# EAGLE design ProcessorTestBoardV2 (EAGLE 7.7.0)
Small breakout board to test basic funtionality of processor. Contains programming connectors, I2C IR sensors, 3V3 and 3V6 voltage regulators, a bus switch, and the MRAM.
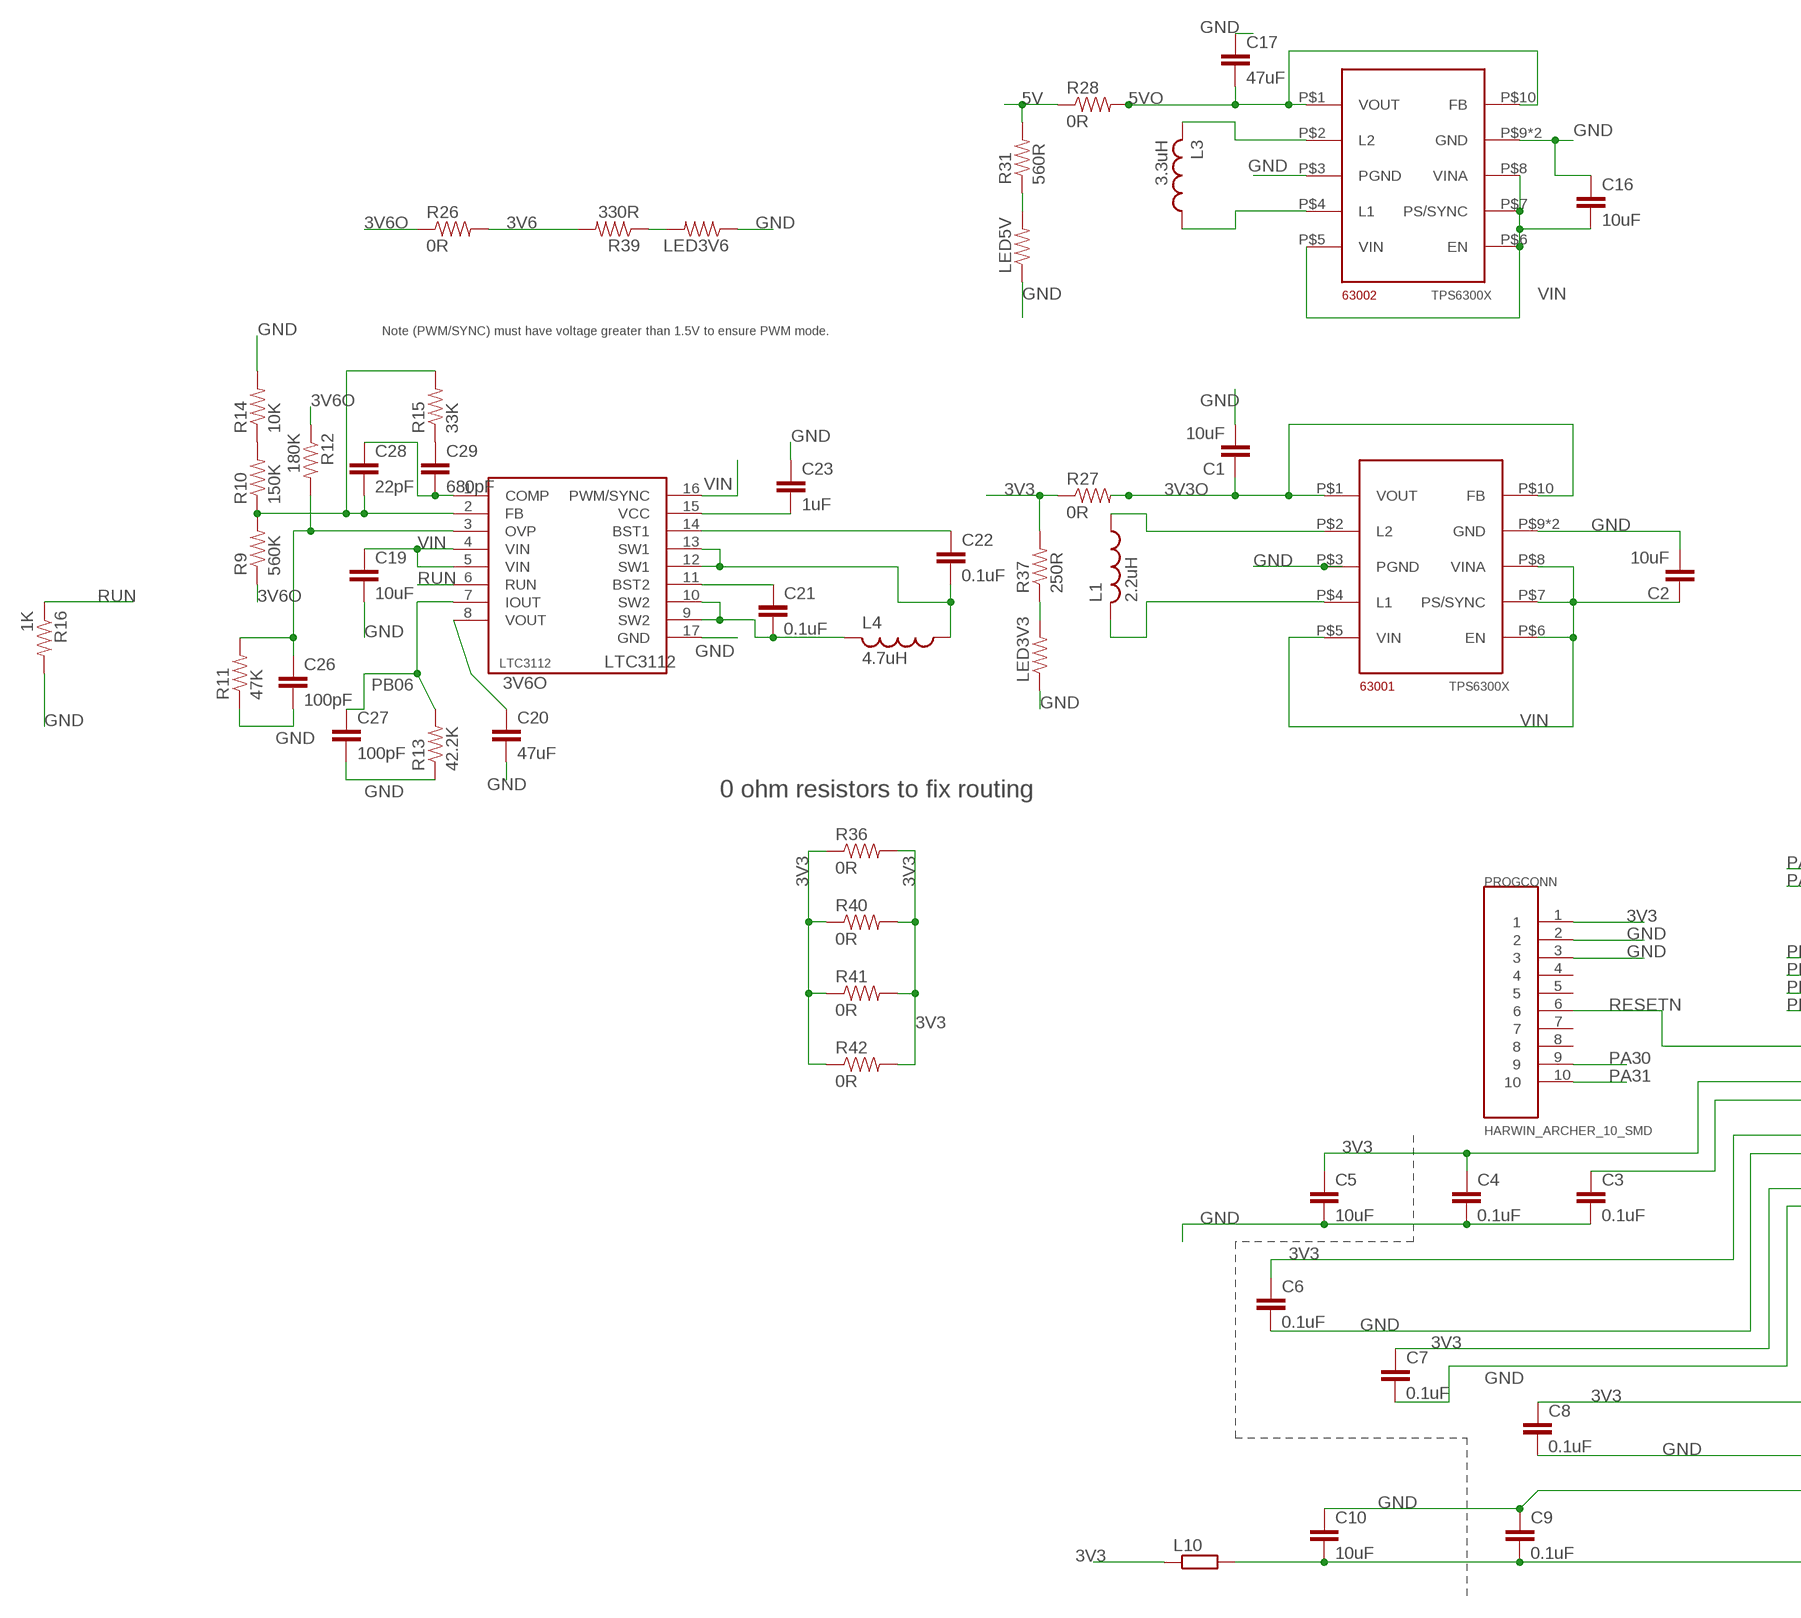
[diagram p0: schematic, sheet 1, part 1 of 2]
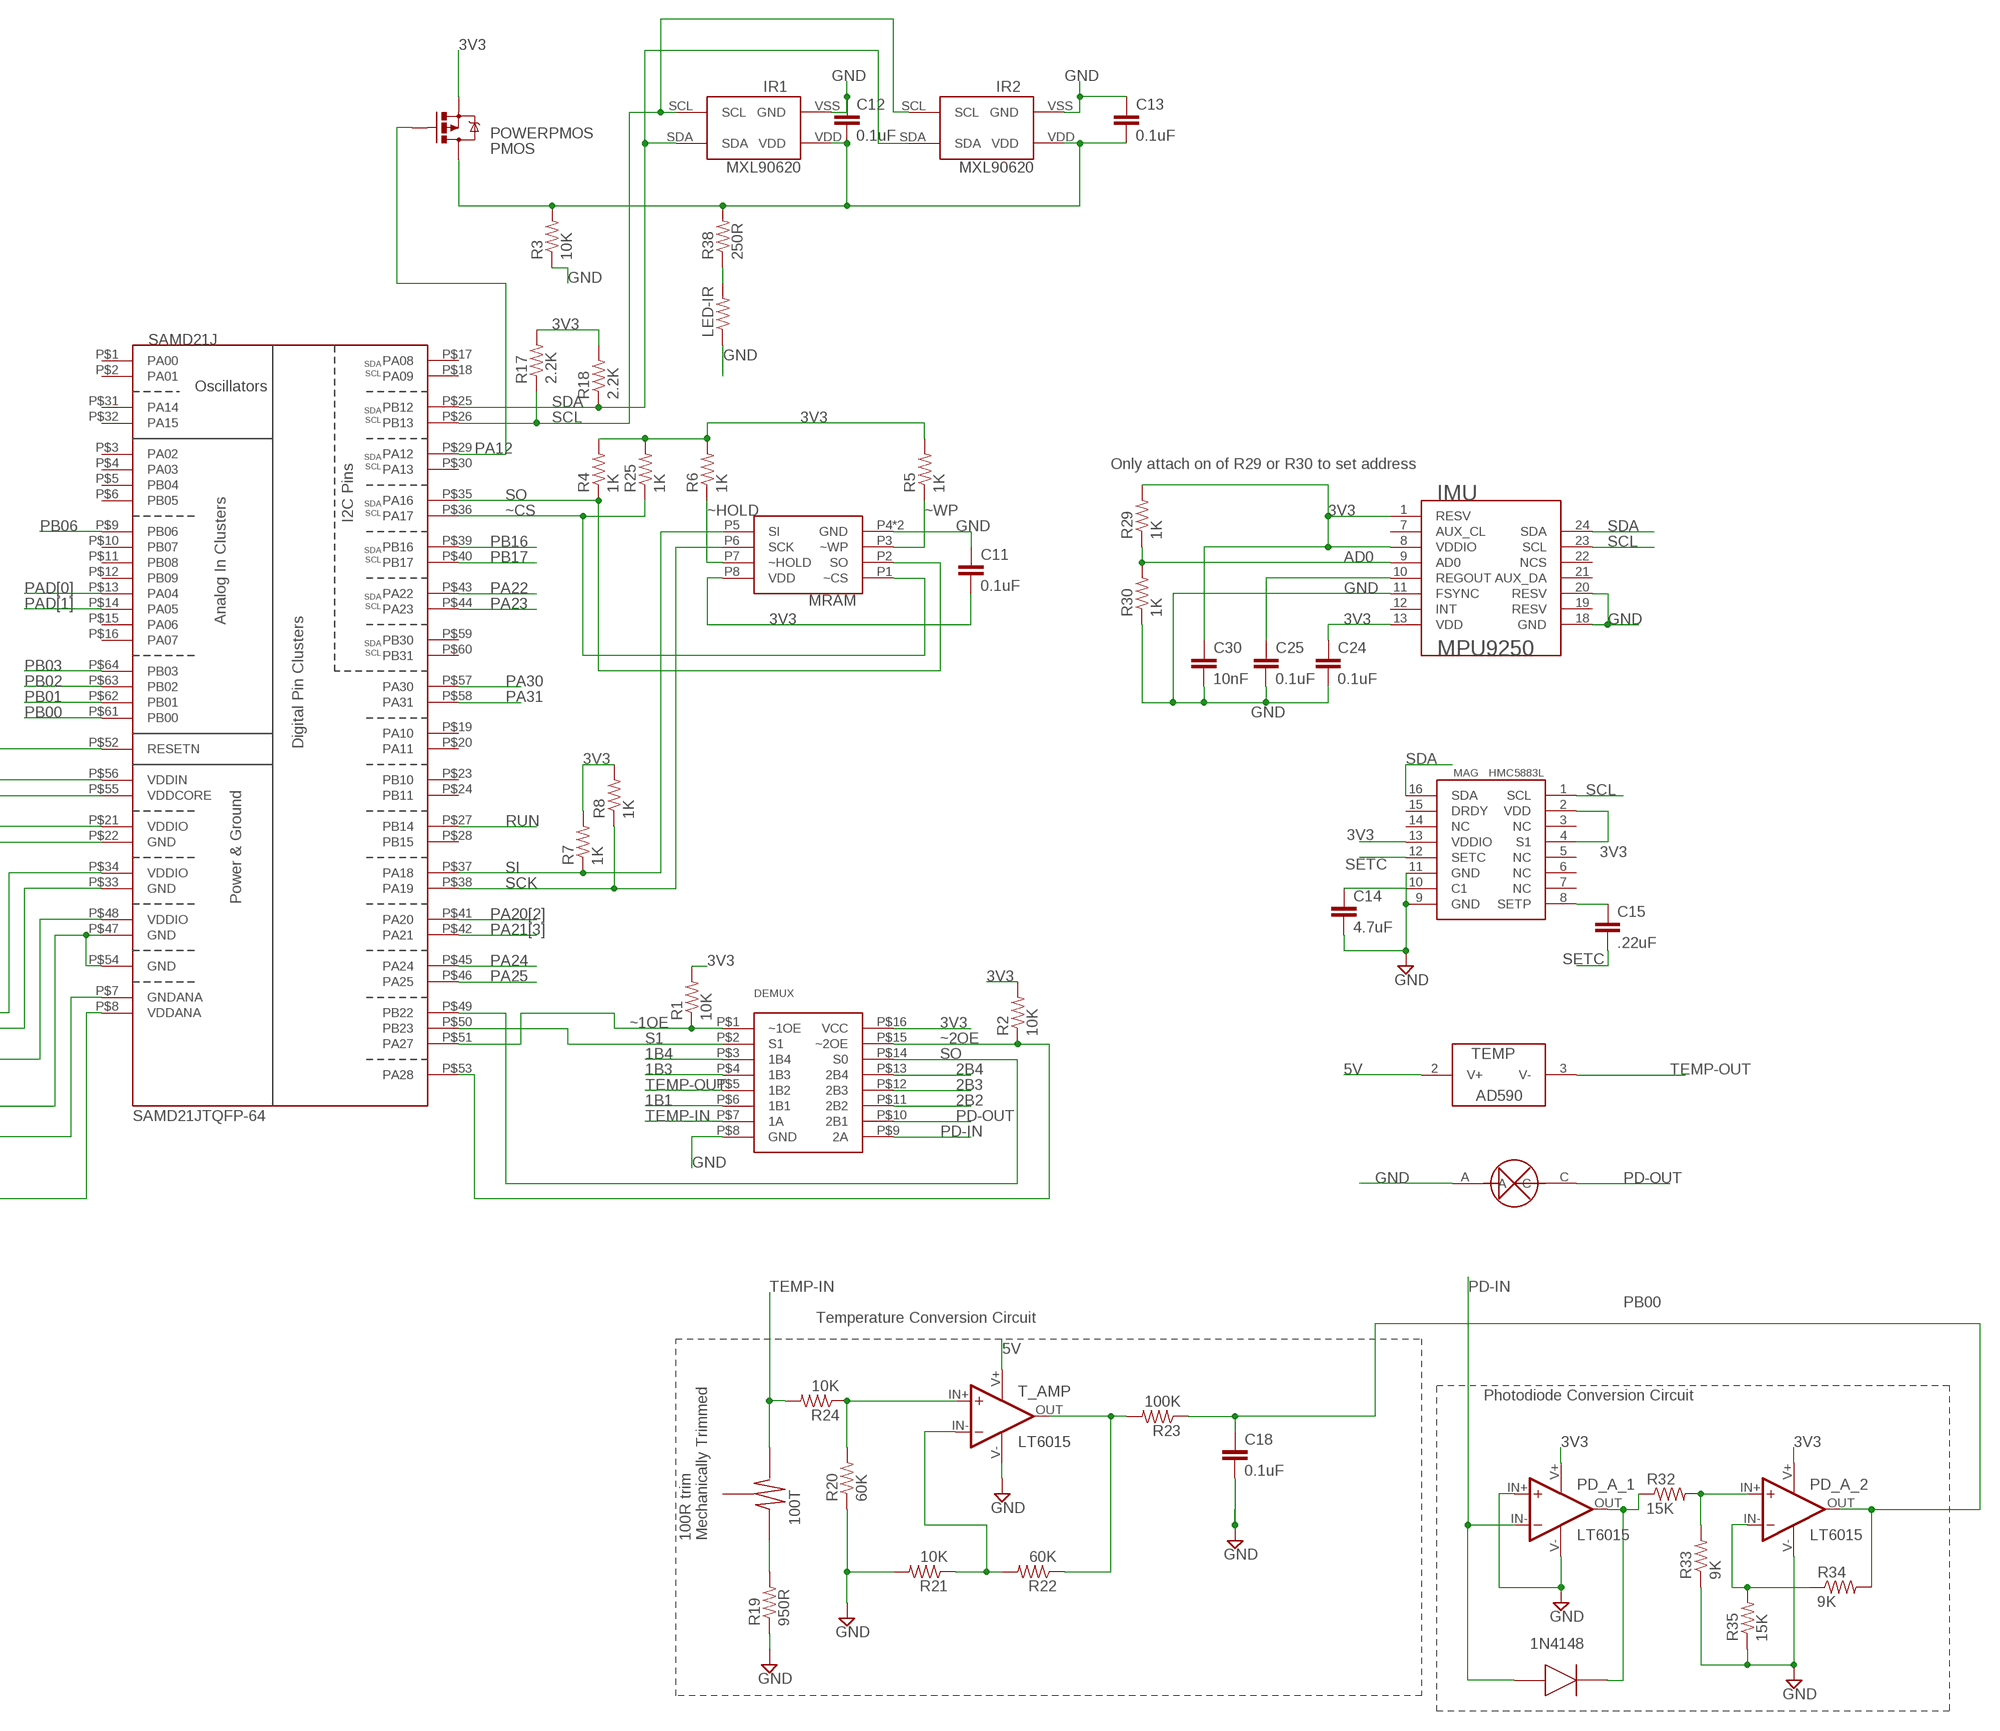
[diagram p1: schematic, sheet 1, part 2 of 2]

## Parts
1N4148  1N4148WS  [SOD-323F]
100T  TRIMPOT-TC33  [TC33X-2]
63001  TPS6300X  [QFN10_POWERPAD]
63002  TPS6300X  [QFN10_POWERPAD]
C1  10uF  CAP0805  [0805]
C2  10uF  CAP0805  [0805]
C3  0.1uF  CAP0805  [0805]
C4  0.1uF  CAP0805  [0805]
C5  10uF  CAP0805  [0805]
C6  0.1uF  CAP0805  [0805]
C7  0.1uF  CAP0805  [0805]
C8  0.1uF  CAP0805  [0805]
C9  0.1uF  CAP0805  [0805]
C10  10uF  CAP0805  [0805]
C11  0.1uF  CAP0805  [0805]
C12  0.1uF  CAP0805  [0805]
C13  0.1uF  CAP0805  [0805]
C14  4.7uF  CAP0805  [0805]
C15  .22uF  CAP0805  [0805]
C16  10uF  CAP0603-CAP  [0603-CAP]
C17  47uF  CAP0603-CAP  [0603-CAP]
C18  0.1uF  CAP0805  [0805]
C19  10uF  CAP0603-CAP  [0603-CAP]
C20  47uF  CAP0805  [0805]
C21  0.1uF  CAP0603-CAP  [0603-CAP]
C22  0.1uF  CAP0603-CAP  [0603-CAP]
C23  1uF  CAP0603-CAP  [0603-CAP]
C24  0.1uF  CAP0805  [0805]
C25  0.1uF  CAP0805  [0805]
C26  100pF  CAP0805  [0805]
C27  100pF  CAP0805  [0805]
C28  22pF  CAP0805  [0805]
C29  680pF  CAP0805  [0805]
C30  10nF  CAP0805  [0805]
DEMUX  SN74CBTLV3253  [SOIC16R]
IMU  MPU9250  [QFN-24-3X3]
IR1  MXL90620  [MXL90620]
IR2  MXL90620  [MXL90620]
L1  2.2uH  L-USL3225M  [L3225M]
L3  3.3uH  L-USL3225M  [L3225M]
L4  4.7uH  L-USL3225M  [L3225M]
L10  R-EU_R0805  [R0805]
LED3V3  RESISTOR  [0805]
LED3V6  RESISTOR  [0805]
LED5V  RESISTOR  [0805]
LED-IR  RESISTOR  [0805]
LTC3112  LTC3112  [DHD16]
MAG  HMC5883L  [HMC5883L]
MRAM  MR25H10CDC  [8PXMO-229]
PD  PHOTODETECTOR  [PHOTODECTORDEVICE2]
PD_A_1  LT6015  [SOT23-5]
PD_A_2  LT6015  [SOT23-5]
PMOS  POWERPMOS  [SO08]
PROGCONN  HARWIN_ARCHER_10_SMD  [HARWIN_ARCHER_10_SMD]
R1  10K  RESISTOR  [0805]
R2  10K  RESISTOR  [0805]
R3  10K  RESISTOR  [0805]
R4  1K  RESISTOR  [0805]
R5  1K  RESISTOR  [0805]
R6  1K  RESISTOR  [0805]
R7  1K  RESISTOR  [0805]
R8  1K  RESISTOR  [0805]
R9  560K  RESISTOR  [0805]
R10  150K  RESISTOR  [0805]
R11  47K  RESISTOR  [0805]
R12  180K  RESISTOR  [0805]
R13  42.2K  RESISTOR  [0805]
R14  10K  RESISTOR  [0805]
R15  33K  RESISTOR  [0805]
R16  1K  RESISTOR  [0805]
R17  2.2K  RESISTOR  [0805]
R18  2.2K  RESISTOR  [0805]
R19  950R  RESISTOR  [0805]
R20  60K  RESISTOR  [0805]
R21  10K  RESISTOR  [0805]
R22  60K  RESISTOR  [0805]
R23  100K  RESISTOR  [0805]
R24  10K  RESISTOR  [0805]
R25  1K  RESISTOR  [0805]
R26  0R  RESISTOR  [0805]
R27  0R  RESISTOR  [0805]
R28  0R  RESISTOR  [0805]
R29  1K  RESISTOR  [0805]
R30  1K  RESISTOR  [0805]
R31  560R  RESISTOR  [0805]
R32  15K  RESISTOR  [0805]
R33  9K  RESISTOR  [0805]
R34  9K  RESISTOR  [0805]
R35  15K  RESISTOR  [0805]
R36  0R  RESISTOR  [0805]
R37  250R  RESISTOR  [0805]
R38  250R  RESISTOR  [0805]
R39  330R  RESISTOR  [0805]
R40  0R  RESISTOR  [0805]
R41  0R  RESISTOR  [0805]
R42  0R  RESISTOR  [0805]
SAMD21J  SAMD21JTQFP-64  [TQFP-64]
T_AMP  LT6015  [SOT23-5]
TEMP  AD590  AD590-SOIC-8  [8SOIC]

## Nets
1B1: DEMUX.P$6(1B1)
1B3: DEMUX.P$4(1B3)
1B4: DEMUX.P$3(1B4)
2B2: DEMUX.P$11(2B2)
2B3: DEMUX.P$12(2B3)
2B4: DEMUX.P$13(2B4)
3V3: C4.1 C5.1 C6.1 C7.1 C8.1 C11.2 C24.1 C30.1 DEMUX.P$16(VCC) IMU.1(RESV) IMU.8(VDDIO) IMU.13(VDD) L10.1 MAG.2(VDD) MAG.4(S1) MAG.13(VDDIO) MRAM.P8(VDD) PD_A_1.V+ PD_A_2.V+ PMOS.1(S) PMOS.2(S) PMOS.3(S) PROGCONN.1 R1.2 R2.2 R4.2 R5.2 R6.2 R7.2 R8.2 R17.2 R18.2 R25.2 R27.1 R29.2 R36.1 R36.2 R37.2 R40.1 R40.2 R41.1 R41.2 R42.1 R42.2 SAMD21J.P$21(VDDIO) SAMD21J.P$34(VDDIO) SAMD21J.P$48(VDDIO) SAMD21J.P$56(VDDIN)
3V3O: 63001.P$1(VOUT) 63001.P$10(FB) C1.1 R27.2
3V6: R26.2 R39.2
3V6O [3V6]: C20.1 LTC3112.8(VOUT) R9.1 R12.1 R26.1
5V [5V]: R28.1 R31.2 T_AMP.V+ TEMP.2(V+)
5VO [5V]: 63002.P$1(VOUT) 63002.P$10(FB) C17.2 R28.2
AD0: IMU.9(AD0) R29.1 R30.2
GND: 63001.P$3(PGND) 63001.P$9(GND) 63001.PAD(GND) 63002.P$3(PGND) 63002.P$9(GND) 63002.PAD(GND) C1.2 C2.2 C3.2 C4.2 C5.2 C6.2 C7.2 C8.2 C9.1 C10.1 C11.1 C12.1 C13.1 C14.2 C16.1 C17.1 C18.2 C19.2 C20.2 C23.1 C24.2 C25.2 C26.2 C27.2 C30.2 DEMUX.P$8(GND) IMU.11(FSYNC) IMU.18(GND) IMU.20(RESV) IR1.VSS(GND) IR2.VSS(GND) LED3V3.1 LED3V6.1 LED5V.1 LED-IR.1 LTC3112.17(GND) MAG.9(GND) MAG.11(GND) MRAM.P4(GND) MRAM.P9(GND) PD.A PD_A_1.IN+ PD_A_1.V- PD_A_2.V- PROGCONN.2 PROGCONN.3 R3.1 R11.1 R13.1 R14.2 R16.2 R19.1 R20.1 R21.2 R30.1 R33.1 R35.1 SAMD21J.P$7(GNDANA) SAMD21J.P$22(GND) SAMD21J.P$33(GND) SAMD21J.P$47(GND) SAMD21J.P$54(GND) T_AMP.V-
N$1: C12.2 C13.2 IR1.VDD IR2.VDD PMOS.5(D) PMOS.6(D) PMOS.7(D) PMOS.8(D) R3.2 R38.2
N$2: 63001.P$4(L1) L1.2
N$3: 63001.P$2(L2) L1.1
N$4: C21.1 LTC3112.11(BST2)
N$5: C22.1 LTC3112.14(BST1)
N$6: C23.2 LTC3112.15(VCC)
N$7: C14.1 MAG.10(C1)
N$8: C3.1 SAMD21J.P$55(VDDCORE)
N$9 [GND]: R20.2 R24.1 T_AMP.IN+
N$10: R22.1 R23.2 T_AMP.OUT
N$11: R21.1 R22.2 T_AMP.IN-
N$12: 1N4148.CATHODE PD_A_1.OUT R32.1
N$13: 100T.P$1 R19.2
N$14: C25.1 IMU.10(REGOUT)
N$15: PD_A_2.IN+ R32.2 R33.2
N$16: LED-IR.2 R38.1
N$17: C9.2 C10.2 L10.2 SAMD21J.P$8(VDDANA)
N$19: PD_A_2.IN- R34.1 R35.2
N$21: LED3V6.2 R39.1
N$22: LED5V.2 R31.1
N$23: LED3V3.2 R37.1
N$36: C15.1 MAG.8(SETP)
N$40: C22.2 L4.1 LTC3112.12(SW1) LTC3112.13(SW1)
N$45: 63002.P$2(L2) L3.2
N$46: 63002.P$4(L1) L3.1
N$53: C21.2 L4.2 LTC3112.9(SW2) LTC3112.10(SW2)
N$54: C28.2 LTC3112.2(FB) R9.2 R10.1 R15.2
N$69: C26.1 LTC3112.3(OVP) R11.2 R12.2
N$70: C29.1 R15.1
N$71: C28.1 C29.2 LTC3112.1(COMP)
N$999: R10.2 R14.1
PA12: PMOS.4(G) SAMD21J.P$29(PA12)
PA20[2]: SAMD21J.P$41(PA20)
PA21[3]: SAMD21J.P$42(PA21)
PA22: SAMD21J.P$43(PA22)
PA23: SAMD21J.P$44(PA23)
PA24: SAMD21J.P$45(PA24)
PA25: SAMD21J.P$46(PA25)
PA30: PROGCONN.9 SAMD21J.P$57(PA30)
PA31: PROGCONN.10 SAMD21J.P$58(PA31)
PAD[0]: SAMD21J.P$13(PA04)
PAD[1]: SAMD21J.P$14(PA05)
PB00: C18.1 PD_A_2.OUT R23.1 R34.2 SAMD21J.P$61(PB00)
PB01: SAMD21J.P$62(PB01)
PB02: SAMD21J.P$63(PB02)
PB03: SAMD21J.P$64(PB03)
PB06: C27.1 LTC3112.7(IOUT) R13.2 SAMD21J.P$9(PB06)
PB16: SAMD21J.P$39(PB16)
PB17: SAMD21J.P$40(PB17)
PD-IN: 1N4148.ANODE DEMUX.P$9(2A) PD_A_1.IN-
PD-OUT: DEMUX.P$10(2B1) PD.C
RESETN: PROGCONN.6 SAMD21J.P$52(RESETN)
RUN: LTC3112.6(RUN) R16.1 SAMD21J.P$27(PB14)
S1: DEMUX.P$2(S1) SAMD21J.P$50(PB23)
SCK: MRAM.P6(SCK) R8.1 SAMD21J.P$38(PA19)
SCL: IMU.23(SCL) IR1.SCL IR2.SCL MAG.1(SCL) R17.1 SAMD21J.P$26(PB13)
SDA: IMU.24(SDA) IR1.SDA IR2.SDA MAG.16(SDA) R18.1 SAMD21J.P$25(PB12)
SETC: C15.2 MAG.12(SETC)
SI: MRAM.P5(SI) R7.1 SAMD21J.P$37(PA18)
SO: DEMUX.P$14(S0) MRAM.P2(SO) R4.1 SAMD21J.P$35(PA16) SAMD21J.P$49(PB22)
TEMP-IN: 100T.P$3 DEMUX.P$7(1A) R24.2
TEMP-OUT: DEMUX.P$5(1B2) TEMP.3(V-)
VIN: 63001.P$5(VIN) 63001.P$6(EN) 63001.P$7(PS/SYNC) 63001.P$8(VINA) 63002.P$5(VIN) 63002.P$6(EN) 63002.P$7(PS/SYNC) 63002.P$8(VINA) C2.1 C16.2 C19.1 LTC3112.4(VIN) LTC3112.5(VIN) LTC3112.16(PWM/SYNC)
~1OE: DEMUX.P$1(~1OE) R1.1 SAMD21J.P$51(PA27)
~2OE: DEMUX.P$15(~2OE) R2.1 SAMD21J.P$53(PA28)
~CS: MRAM.P1(~CS) R25.1 SAMD21J.P$36(PA17)
~HOLD: MRAM.P7(~HOLD) R6.1
~WP: MRAM.P3(~WP) R5.1
Unconnected: 100T.P$2 IMU.7(AUX_CL) IMU.12(INT) IMU.19(RESV) IMU.21(AUX_DA) IMU.22(NCS) MAG.3(NC) MAG.5(NC) MAG.6(NC) MAG.7(NC) MAG.14(NC) MAG.15(DRDY) PROGCONN.4 PROGCONN.5 PROGCONN.7 PROGCONN.8 SAMD21J.P$1(PA00) SAMD21J.P$2(PA01) SAMD21J.P$3(PA02) SAMD21J.P$4(PA03) SAMD21J.P$5(PB04) SAMD21J.P$6(PB05) SAMD21J.P$10(PB07) SAMD21J.P$11(PB08) SAMD21J.P$12(PB09) SAMD21J.P$15(PA06) SAMD21J.P$16(PA07) SAMD21J.P$17(PA08) SAMD21J.P$18(PA09) SAMD21J.P$19(PA10) SAMD21J.P$20(PA11) SAMD21J.P$23(PB10) SAMD21J.P$24(PB11) SAMD21J.P$28(PB15) SAMD21J.P$30(PA13) SAMD21J.P$31(PA14) SAMD21J.P$32(PA15) SAMD21J.P$59(PB30) SAMD21J.P$60(PB31)

## Notes on the sheet
- Note (PWM/SYNC) must have voltage greater than 1.5V to ensure PWM mode.
- Only attach on of R29 or R30 to set address
- 0 ohm resistors to fix routing
- Temperature Conversion Circuit
- Photodiode Conversion Circuit
- 100R trim
  Mechanically Trimmed

## Library data of the parts
1N4148 = CNTRL_BOARD:1N4148WS
100T = CNTRL_BOARD:TRIMPOT-TC33
63001 = CNTRL_BOARD:TPS6300X
63002 = CNTRL_BOARD:TPS6300X; OC_NEWARK: unknown
C1-C13 C18 C24 C25 C30 = CNTRL_BOARD:CAP: Capacitor Standard 0603 ceramic capacitor, and 0.1" leaded capacitor.
C14 = CNTRL_BOARD:CAP: Capacitor Standard 0603 ceramic capacitor, and 0.1" leaded capacitor.; MF: AVX CORPORATION; MPN: 08056D475KAT2A; OC_NEWARK: 84K8400
C15 = CNTRL_BOARD:CAP: Capacitor Standard 0603 ceramic capacitor, and 0.1" leaded capacitor.; MF: AVX CORPORATION; MPN: 08053C224KAT2A; OC_NEWARK: 96K4775
C16 = CNTRL_BOARD:CAP: Capacitor Standard 0603 ceramic capacitor, and 0.1" leaded capacitor.; MPN: C1608X5R1A225K080AC; OC_NEWARK: 04X3244
C17 C20 = CNTRL_BOARD:CAP: Capacitor Standard 0603 ceramic capacitor, and 0.1" leaded capacitor.; MPN: EMK107B7474KA-T; OC_NEWARK: 77M8434
C19 C23 = CNTRL_BOARD:CAP: Capacitor Standard 0603 ceramic capacitor, and 0.1" leaded capacitor.; OC_NEWARK: unknown
C21 C22 = CNTRL_BOARD:CAP: Capacitor Standard 0603 ceramic capacitor, and 0.1" leaded capacitor.; MPN: 0603YC104JAT2A; OC_NEWARK: 96M1175
C26 C27 = CNTRL_BOARD:CAP: Capacitor Standard 0603 ceramic capacitor, and 0.1" leaded capacitor.; MF: AVX CORPORATION; MPN: 08051A101J4T4A; OC_NEWARK: 55J5675
C28 = CNTRL_BOARD:CAP: Capacitor Standard 0603 ceramic capacitor, and 0.1" leaded capacitor.; MF: AVX CORPORATION; MPN: 08051A220JAT2A; OC_NEWARK: 96K4769
C29 = CNTRL_BOARD:CAP: Capacitor Standard 0603 ceramic capacitor, and 0.1" leaded capacitor.; MPN: 08055C681KAT2A; OC_NEWARK: 94W2947
DEMUX = CNTRL_BOARD:SN74CBTLV3253
IMU = CNTRL_BOARD:MPU9250
IR1 IR2 = CNTRL_BOARD:MXL90620
L1 = resistor:L-US: INDUCTOR, American symbol
L3 = resistor:L-US: INDUCTOR, American symbol; MPN: JMK212BJ335KG-T; OC_NEWARK: 08P5148
L4 = resistor:L-US: INDUCTOR, American symbol; OC_NEWARK: unknown
L10 = rcl:R-EU_: RESISTOR, European symbol
LED3V3 LED3V6 LED5V LED-IR R1-R8 R16 R19-R42 = CNTRL_BOARD:RESISTOR
LTC3112 = CNTRL_BOARD:LTC3112; MPN: LTC3112EFE#PBF; OC_NEWARK: 24T2752
MAG = CNTRL_BOARD:HMC5883L; MPN: HMC5883L-TR; OC_NEWARK: 20T0699
MRAM = mram:MR25H10CDC
PD = Solar Panel Parts:PHOTODETECTOR
PD_A_1 PD_A_2 T_AMP = CNTRL_BOARD:LT6015
PMOS = CNTRL_BOARD:POWERPMOS
PROGCONN = CNTRL_BOARD:HARWIN_ARCHER_10_SMD
R9 = CNTRL_BOARD:RESISTOR; MPN: MC01W08051560K; OC_NEWARK: 94W6326
R10 R11 R13-R15 = CNTRL_BOARD:RESISTOR; OC_NEWARK: unknown
R12 = CNTRL_BOARD:RESISTOR; MPN: ERJ-6GEYJ184V; OC_NEWARK: 53W4944
R17 R18 = CNTRL_BOARD:RESISTOR; MPN: SR1-0805-222; OC_NEWARK: 33C6600
SAMD21J = SAMD21J_Easy:SAMD21J
TEMP = CNTRL_BOARD:AD590-SOIC-8

## Net classes
1 GND: width 0.508 mm, drill 0.254 mm, clearance 0.305 mm
2 3V3: width 0.508 mm, drill 0.254 mm, clearance 0.305 mm
3 3V6: width 1.016 mm, drill 0.254 mm, clearance 0.305 mm
4 5V: width 0.508 mm, drill 0.254 mm, clearance 0.305 mm

## Board
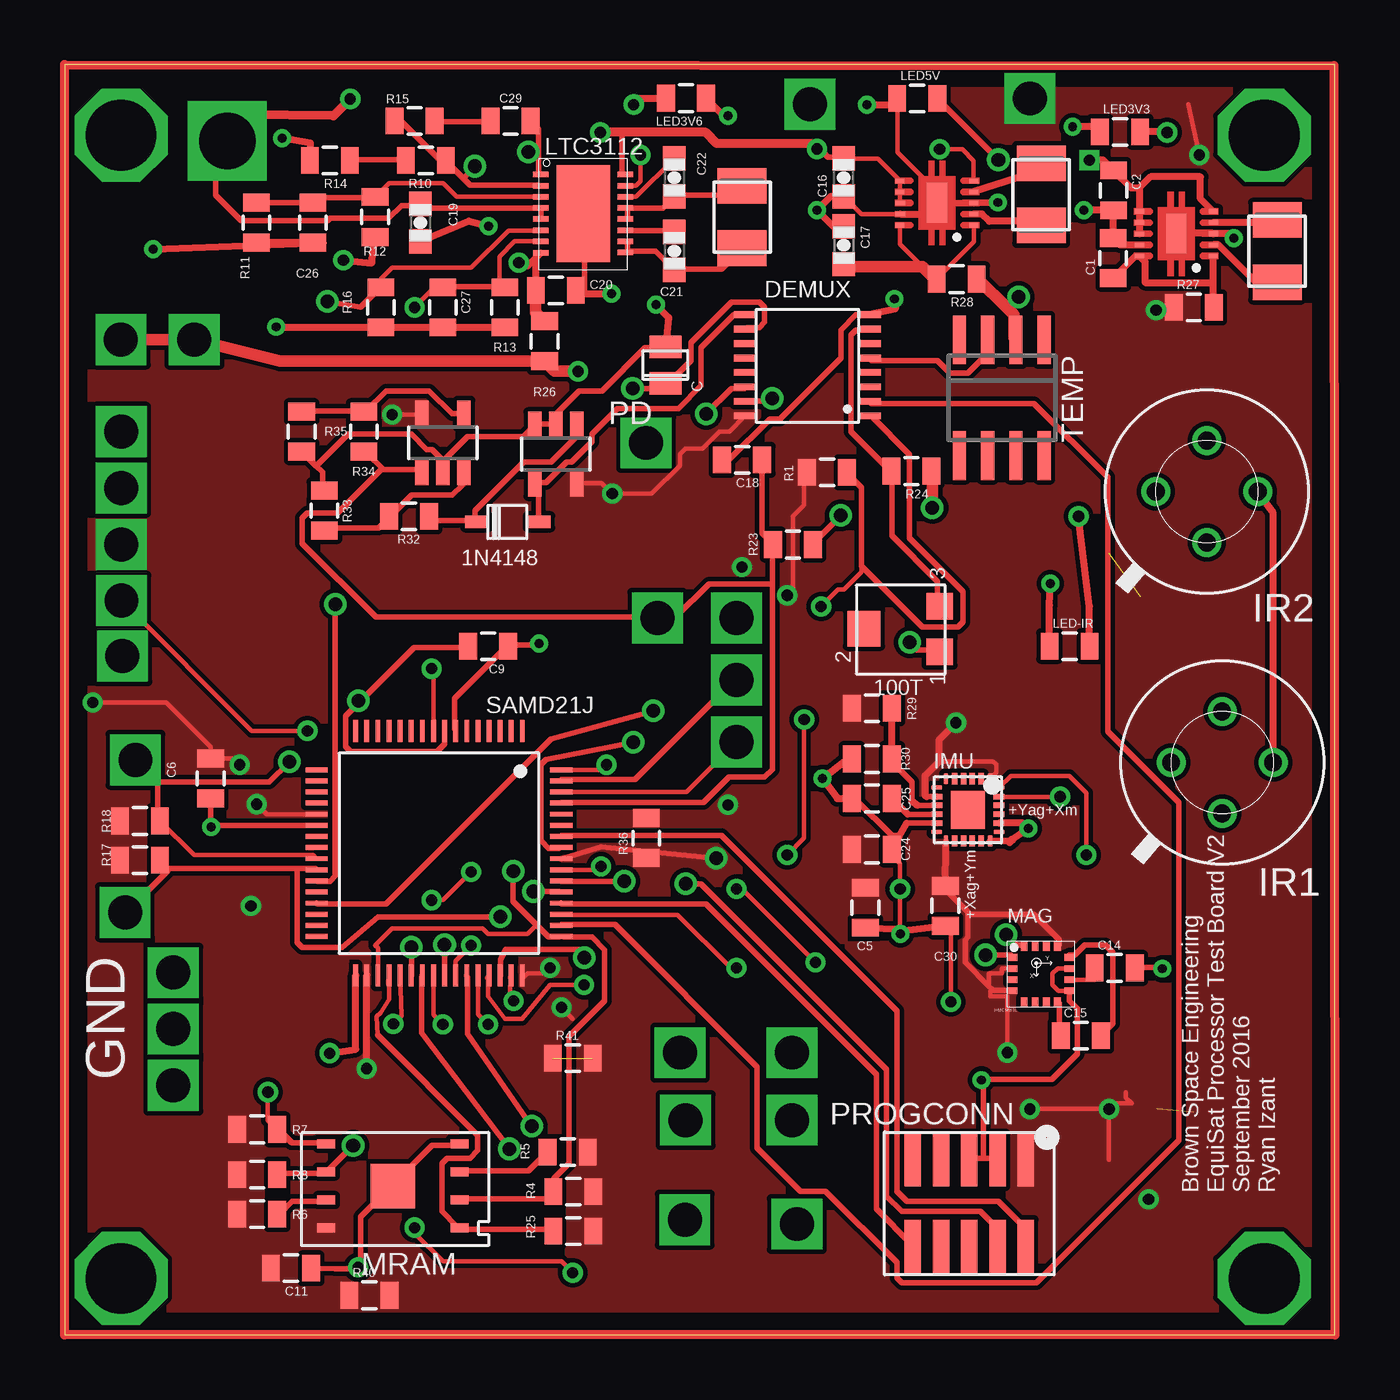
[diagram p2: board, top side]
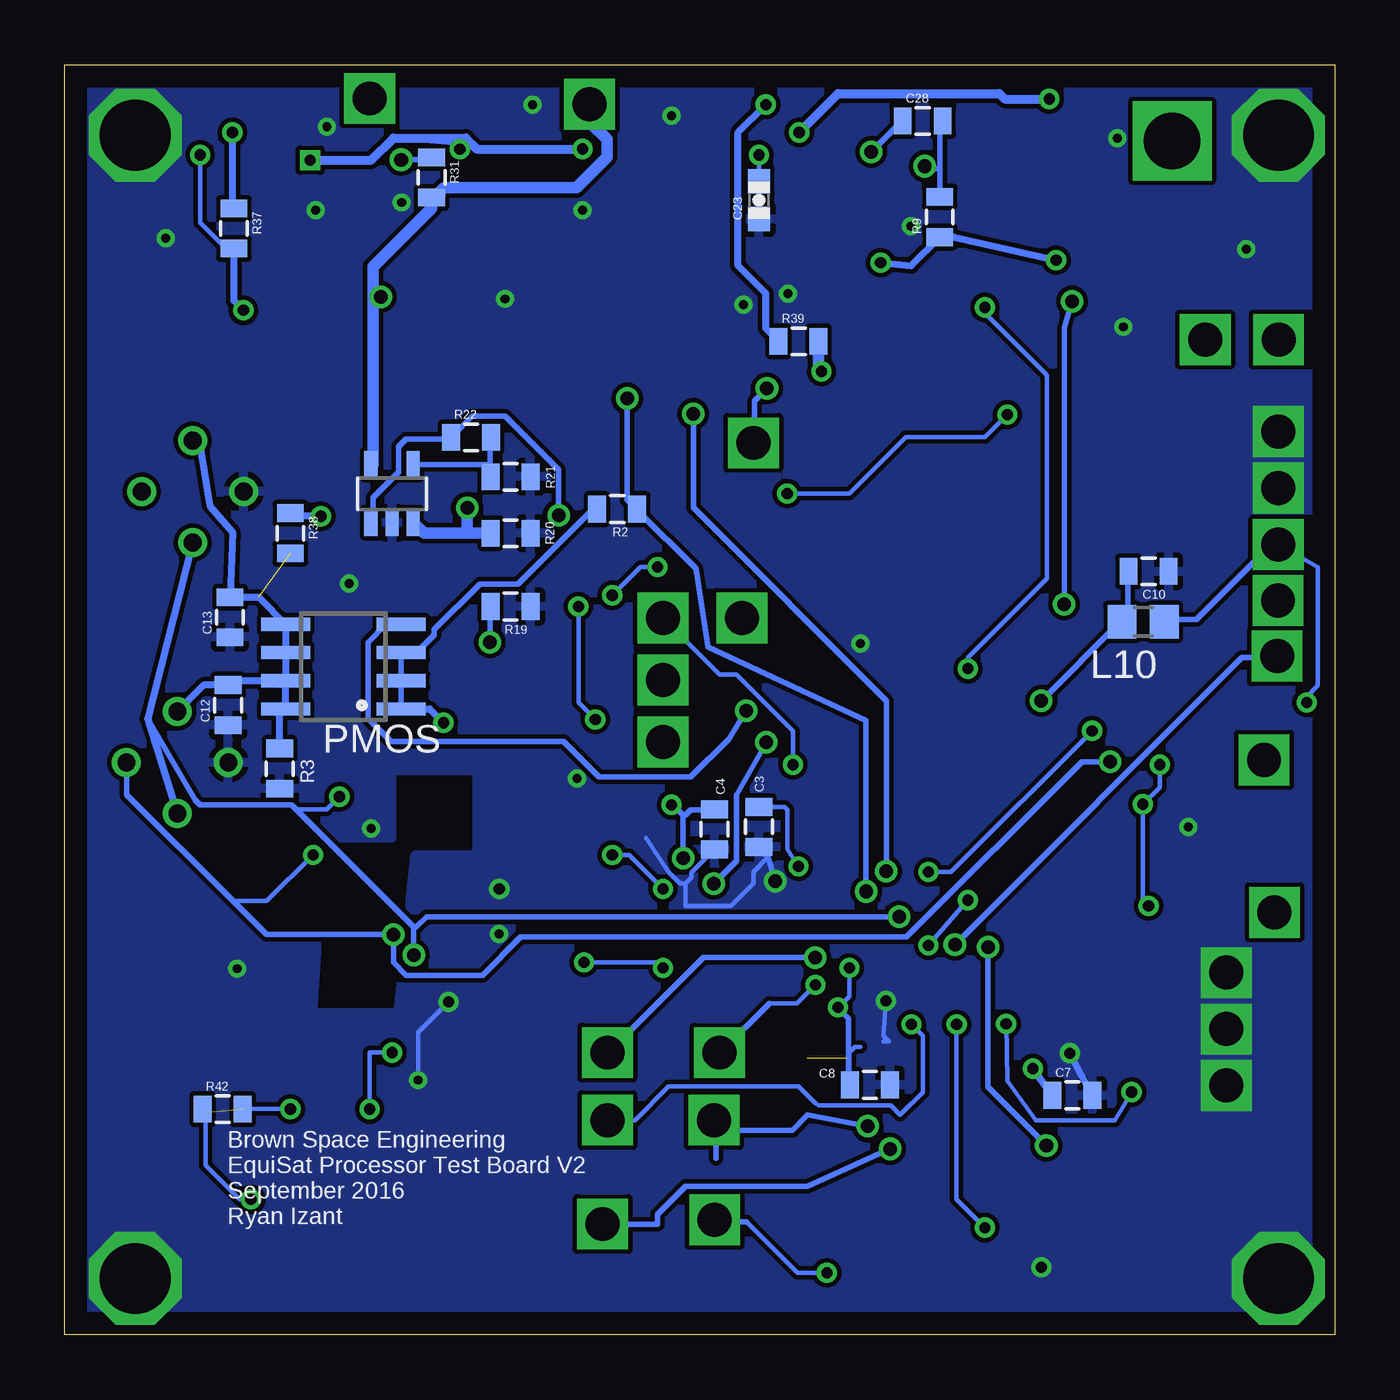
[diagram p3: board, bottom side, seen from below]

Size 57.15 x 57.15 mm. Coordinates in mm from the lower left corner, seen from the top.
Outline: 0,0 57.15,0 57.15,57.15 0,57.15 0,0
Copper layers (1*16): Top 0.035mm / dielectric 1.5mm / Bottom 0.035mm
Design rules "default": minimum track width 10mil, minimum drill 24mil, track to track 8mil, track to pad 8mil, pad to pad 8mil, via to via 8mil, smd to smd 8mil, copper to edge 40mil, drill to drill 8mil, minimum pad ring 10mil, minimum via ring 8mil, stop-mask expansion 4mil, vias tented up to drill 0mil, thermal gap 10mil
bKeepout: area 38.9,14.5 to 45.5,25.1

### Footprints (pad centres in the part's own frame; a part is rotated, then mirrored left to right if it is on the bottom)
SOD-323F = smd 0.55 x 1.05: ANODE 0,-2.8; CATHODE 0,0
TC33X-2 = smd 1.2 x 1.2: P$1 0,0; P$3 2.05,0 | smd 1.6 x 1.5: P$2 1.04,3.41
QFN10_POWERPAD = smd 0.203 x 0.406: P$1 0.14,0.241; P$2 0.641,0.241; P$3 1.141,0.242; P$4 1.639,0.239; P$5 2.139,0.242; P$6 2.14,3.559; P$7 1.639,3.559; P$8 1.139,3.555; P$9 0.641,3.555; P$10 0.139,3.558 | smd 1.778 x 0.914: PAD 1.155,1.898
0805 = smd 0.8 x 1.2: 1 -0.9,0; 2 0.9,0
0603-CAP = smd 1.1 x 1: 1 -0.85,0; 2 0.85,0
SOIC16R = smd 0.3 x 1: P$1 0,0; P$2 0.65,0; P$3 1.3,0; P$4 1.95,0; P$5 2.6,0; P$6 3.25,0; P$7 3.9,0; P$8 4.55,0; P$9 4.55,5.6; P$10 3.9,5.6; P$11 3.25,5.6; P$12 2.6,5.6; P$13 1.95,5.6; P$14 1.3,5.6; P$15 0.65,5.6; P$16 0,5.6
QFN-24-3X3 = smd 0.5 x 0.2: 1 -1.4,1; 6 -1.4,-1; 13 1.4,-1; 18 1.4,1 | smd 0.5 x 0.25: 2 -1.4,0.6; 3 -1.4,0.2; 4 -1.4,-0.2; 5 -1.4,-0.6; 14 1.4,-0.6; 15 1.4,-0.2; 16 1.4,0.2; 17 1.4,0.6 | smd 0.2 x 0.5: 7 -1,-1.4; 12 1,-1.4; 19 1,1.4; 24 -1,1.4 | smd 0.25 x 0.5: 8 -0.6,-1.4; 9 -0.2,-1.4; 10 0.2,-1.4; 11 0.6,-1.4; 20 0.6,1.4; 21 0.2,1.4; 22 -0.2,1.4; 23 -0.6,1.4 | smd 1.7 x 1.54: P 0,0
MXL90620 = drill 0.8: SCL 2.293,0; VDD -2.293,0; VSS 0,-2.294 | drill 0.8 pad 1.2: SDA 0,2.294
L3225M = smd 1.6 x 2.2: 1 -1.4,0; 2 1.4,0
R0805 = smd 1.3 x 1.5: 1 -0.95,0; 2 0.95,0
DHD16 = smd 0.25 x 0.7: 1 0.125,0.35; 2 0.625,0.35; 3 1.125,0.35; 4 1.625,0.35; 5 2.125,0.35; 6 2.638,0.35; 7 3.125,0.35; 8 3.638,0.35; 9 3.625,4.15; 10 3.125,4.15; 11 2.625,4.15; 12 2.125,4.15; 13 1.625,4.15; 14 1.125,4.15; 15 0.625,4.15; 16 0.125,4.15 | smd 4.34 x 2.44: 17 1.875,2.25
HMC5883L = smd 0.45 x 0.3: 1 0.225,2.25; 2 0.225,1.75; 3 0.225,1.25; 4 0.225,0.75; 9 2.775,0.75; 10 2.775,1.25; 11 2.775,1.75; 12 2.775,2.25 | smd 0.3 x 0.45: 5 0.75,0.225; 6 1.25,0.225; 7 1.75,0.225; 8 2.25,0.225; 13 2.25,2.775; 14 1.75,2.775; 15 1.25,2.775; 16 0.75,2.775
8PXMO-229 = smd 0.813 x 0.406: P1 -3,1.895; P2 -3,0.635; P3 -3,-0.635; P4 -3,-1.895; P5 3,-1.895; P6 3,-0.635; P7 3,0.635; P8 3,1.895 | smd 2 x 2: P9 0,0
PHOTODECTORDEVICE2 = smd 1 x 1.45: A 0.76,0.4; C -0.88,0.4
SOT23-5 = smd 0.6 x 1.2: IN+ 0.95,-1.306; IN- 0.95,1.306; OUT -0.95,-1.306; V+ -0.95,1.306; V- 0,-1.306
SO08 = smd 0.6 x 2.2: 1 -1.905,-2.6; 2 -0.635,-2.6; 3 0.635,-2.6; 4 1.905,-2.6; 5 1.905,2.6; 6 0.635,2.6; 7 -0.635,2.6; 8 -1.905,2.6
HARWIN_ARCHER_10_SMD = smd 0.74 x 2.4: 1 6.35,0; 2 5.08,0; 3 3.81,0; 4 2.54,0; 5 1.27,0; 6 1.27,-3.89; 7 2.54,-3.89; 8 3.81,-3.89; 9 5.08,-3.89; 10 6.35,-3.89
TQFP-64 = smd 1 x 0.22: P$1 -5.5,3.5; P$2 -5.5,3; P$3 -5.5,2.5; P$4 -5.5,2; P$5 -5.5,1.5; P$6 -5.5,1; P$7 -5.5,0.5; P$8 -5.5,0; P$9 -5.5,-0.5; P$10 -5.5,-1; P$11 -5.5,-1.5; P$12 -5.5,-2; P$13 -5.5,-2.5; P$14 -5.5,-3; P$15 -5.5,-3.5; P$16 -5.5,-4; P$33 5.5,-4; P$34 5.5,-3.5; P$35 5.5,-3; P$36 5.5,-2.5; P$37 5.5,-2; P$38 5.5,-1.5; P$39 5.5,-1; P$40 5.5,-0.5; P$41 5.5,0; P$42 5.5,0.5; P$43 5.5,1; P$44 5.5,1.5; P$45 5.5,2; P$46 5.5,2.5; P$47 5.5,3; P$48 5.5,3.5 | smd 0.22 x 1: P$17 -3.75,-5.75; P$18 -3.25,-5.75; P$19 -2.75,-5.75; P$20 -2.25,-5.75; P$21 -1.75,-5.75; P$22 -1.25,-5.75; P$23 -0.75,-5.75; P$24 -0.25,-5.75; P$25 0.25,-5.75; P$26 0.75,-5.75; P$27 1.25,-5.75; P$28 1.75,-5.75; P$29 2.25,-5.75; P$30 2.75,-5.75; P$31 3.25,-5.75; P$32 3.75,-5.75; P$49 3.75,5.25; P$50 3.25,5.25; P$51 2.75,5.25; P$52 2.25,5.25; P$53 1.75,5.25; P$54 1.25,5.25; P$55 0.75,5.25; P$56 0.25,5.25; P$57 -0.25,5.25; P$58 -0.75,5.25; P$59 -1.25,5.25; P$60 -1.75,5.25; P$61 -2.25,5.25; P$62 -2.75,5.25; P$63 -3.25,5.25; P$64 -3.75,5.25
8SOIC = smd 0.6 x 2.2: 1 -1.905,-2.6; 2 -0.635,-2.6; 3 0.635,-2.6; 4 1.905,-2.6; 5 1.905,2.6; 6 0.635,2.6; 7 -0.635,2.6; 8 -1.905,2.6

### Placement (x,y rotation side)
1N4148  18.54,36.58 90 top
100T  39.37,30.73 90 top
63001  51.91,48.4 90 top
63002  41.15,49.78 90 top
C1  47.18,48.44 90 top
C2  47.19,51.49 270 top
C3  25.91,22.86 270 bottom
C4  27.91,22.74 270 bottom
C5  36.03,19.22 270 top
C6  6.57,25.03 270 top
C7  11.81,10.78 0 bottom
C8  20.92,11.25 0 bottom
C9  19.05,30.99 180 top
C10  8.38,34.35 180 bottom
C11  10.19,3 180 top
C12  49.79,28.33 90 bottom
C13  49.71,32.29 90 bottom
C14  47.24,16.51 0 top
C15  45.72,13.46 0 top
C16  35.05,52.07 90 top
C17  35.05,49.02 270 top
C18  30.48,39.37 180 top
C19  16,50.04 270 top
C20  22.1,46.99 0 top
C21  27.43,48.77 270 top
C22  27.43,52.07 270 top
C23  25.91,51.05 90 bottom
C24  36.32,21.84 0 top
C25  36.32,24.13 180 top
C26  11.18,50.04 270 top
C27  17.02,46.23 270 top
C28  18.54,54.61 0 bottom
C29  20.07,54.61 0 top
C30  39.62,19.3 270 top
DEMUX  36.22,41.35 90 top
IMU  40.64,23.62 270 top
IR1  52.08,25.75 270 top
IR2  51.38,37.94 270 top
L1  54.55,48.76 90 top
L3  43.94,51.31 270 top
L4  30.48,50.29 270 top
L10  8.62,32.09 180 bottom
LED3V3  47.48,54.13 0 top
LED3V6  27.96,55.63 180 top
LED5V  38.36,55.63 0 top
LED-IR  45.21,30.99 0 top
LTC3112  21.08,52.32 270 top
MAG  42.42,14.73 0 top
MRAM  14.77,6.7 180 top
PD  27.43,43.69 90 top
PD_A_1  22.1,39.62 180 top
PD_A_2  17.02,40.13 0 top
PMOS  44.61,30.06 90 bottom
PROGCONN  36.89,7.87 0 top
R1  34.3,38.81 180 top
R2  32.29,37.15 180 bottom
R3  47.47,25.48 90 bottom
R4  22.89,6.45 0 top
R5  22.63,8.23 0 top
R6  8.66,5.43 180 top
R7  8.66,9.24 180 top
R8  8.66,7.21 180 top
R9  17.78,50.29 90 bottom
R10  16.26,52.83 180 top
R11  8.64,50.04 90 top
R12  13.97,50.29 90 top
R13  19.81,46.23 90 top
R14  11.94,52.83 180 top
R15  15.75,54.61 180 top
R16  14.22,46.23 270 top
R17  3.39,21.36 180 top
R18  3.39,23.13 180 top
R19  37.08,32.77 180 bottom
R20  37.08,36.07 180 bottom
R21  37.08,38.61 0 bottom
R22  38.86,40.39 0 bottom
R23  32.77,35.56 0 top
R24  38.1,38.86 180 top
R25  22.89,4.67 0 top
R26  21.59,44.7 270 top
R27  50.8,46.23 0 top
R28  40.13,47.5 180 top
R29  36.32,28.19 180 top
R30  36.32,25.91 0 top
R31  40.64,52.07 270 bottom
R32  15.49,36.83 180 top
R33  11.68,37.08 270 top
R34  13.46,40.64 270 top
R35  10.67,40.64 90 top
R36  26.16,22.35 90 top
R37  49.53,49.78 270 bottom
R38  46.99,36.07 270 bottom
R39  24.13,44.7 0 bottom
R40  13.72,1.78 0 top
R41  22.86,12.45 0 top
R42  50.04,10.16 0 bottom
SAMD21J  17.09,21.67 270 top
T_AMP  42.42,37.85 0 bottom
TEMP  42.16,42.16 180 top

### Tracks (layer width: path | path; a pad name or v marks a point on that pad's centre or on a via)
3V3  (via drill 0.5, 0.51, 0.61, 1.52)  (2 unrouted)
  Top 0.203: v51.05,53.09 50.55,55.37 | PD_A_2.V+ 16.03,41.4 v14.73,41.4 | PD_A_1.V+ 24.17,38.32 v24.64,37.85 26.42,37.85 27.69,39.12 27.69,39.62 27.94,39.88 28.7,39.88 29.46,40.64 29.91,40.64 DEMUX.P$16 | MAG.2 42.16,16.48 42.16,16.26 41.59,16.26 41.59,15.69 | MAG.4 41.66,15.48 41.66,15.24 42.42,15.24 v42.42,12.7 | v43.43,10.16 v46.99,10.16 | v46.99,10.16 46.99,7.87 | v1.27,28.45 4.57,28.45 6.57,26.45 C6.1 7.6,25.93 v7.87,25.65 | R1.2 33.4,38.74 33.27,38.61 33.27,37.34 32.77,36.83 32.77,33.53 v32.51,33.27 | v30.48,34.54 30.48,34.8 | v8.38,19.3 8.38,19.05 | SAMD21J.P$48 20.75,16.17 20.83,16.26 21.59,16.26 v21.84,16.51 | v22.35,14.73 22.86,14.22 | 39.35,25.81 41.76,25.81 41.91,25.65 41.91,25.29 IMU.1 | v46.99,10.16 47.24,10.41 48.01,10.41 47.75,10.67 47.75,10.92 | v48.77,6.1 49.02,5.84 | v8.64,23.88 9.09,23.42 SAMD21J.P$21 11.33,23.41 9.11,23.41 v8.64,23.88
  Top 0.254: 39.64,22 IMU.13 | IMU.8 38.77,24.22 | 40.64,18.92 40.64,19.04 39.61,20.07 C30.1 | 40.64,18.92 40.64,17.89 40.53,17.78 40.53,16.75 41.59,15.69 41.78,15.49 42.58,15.49 MAG.4 | 40.64,18.92 43.61,18.92 44.76,17.78 44.76,17.55 MAG.13 | v29.32,21.44 24.13,21.95 SAMD21J.P$56 | SAMD21J.P$48 20.64,16.18 20.61,16.05
  Top 0.305: v13.59,11.98 SAMD21J.P$34 | C30.1 39.64,22 | IMU.8 | 38.77,24.22 38.72,24.27 38.72,25.18 39.35,25.81 39.35,26.79 v40.1,27.54 | R27.1 49.77,46.1 v49.1,46.1
  Bottom 0.203: R37.2 49.9,48.88 51.05,50.04 v51.05,53.09 | v14.73,41.4 15.75,40.39 19.3,40.39 21.84,37.85 v24.64,37.85 | v42.42,12.7 43.43,12.7 v43.43,10.16 | v1.27,28.45 1.27,28.7 0.76,29.21 0.76,34.54 v2.54,35.56 | v32.51,33.27 31.24,34.54 v30.48,34.54 | v7.87,25.65 7.87,24.64 v8.64,23.88 8.64,19.56 v8.38,19.3 | v21.84,16.51 21.84,15.24 v22.35,14.73 | 21.89,11.27 21.84,11.32 21.84,12.7 21.59,12.95 21.34,12.95 | R42.2 v46.99,10.16 | R42.1 50.8,10.02 50.8,7.62 49.28,6.1 v48.77,6.1
  Bottom 0.254: R2.2 33.21,37.1 33.44,37.1 36.75,33.78 38.47,33.78 40.53,31.73 40.53,31.5 41.21,30.81 41.9,30.81 PMOS.3 42.01,30.58 42.01,29.55 PMOS.2 42.01,29.32 42.01,28.3 PMOS.1 | 29.32,23.38 v29.32,21.44 | 29.32,23.38 29.78,23.84 v29.85,23.85 | C4.1 27.95,23.61 28.98,23.61 29.21,23.38 29.32,23.38 | L10.1 7.61,32.18 6.24,32.18 2.92,35.5 2.58,35.5 v2.54,35.56 | C8.1 21.89,11.27 21.89,14.24 22.35,14.69 v22.35,14.73
  Bottom 0.305: C7.1 v13.59,11.98 | v49.1,46.1 49.53,46.53 R37.2 | PMOS.1 40.73,28.16 v40.1,27.54
  other vias: 43.43,55.63
  pour Top (no thermals): -6.46,69.6 64.34,69.6 64.59,-1.8 -6.32,-1.8
3V3O
  Top 0.305: R27.2 51.67,46.26 51.67,47.35 | 51.67,47.35 63001.P$1 | C1.1 48.18,48.54 63001.P$10 48.6,48.3 48.6,47.35 51.67,47.35
3V6  (via drill 0.51, 1.52)
  Top 0.508: v2.53,44.78 v5.83,44.78 9.69,43.8 R26.2 22.04,43.35 v23.1,43.35
  Bottom 0.508: v23.1,43.35 23.23,43.48 R39.2
3V6O  (via drill 0.51)
  Top 0.305: C20.1 21.2,48.45 LTC3112.8 20.84,48.1 v20.43,48.24 | v12.55,48.35 13.82,48.22 R12.1
  Top 0.508: R26.1 21.2,46 C20.1
  Bottom 0.305: v20.43,48.24 19.07,48.1 R9.1 17.14,49.39 v12.55,48.35
5V  (via drill 0.61, 1.52)
  Top 0.508: 42.41,46.18 42.7,45.9 42.7,44.87 TEMP.2 | 42.41,46.18 41.1,47.5 R28.1 | v42.93,46.7 42.41,46.18
  Bottom 0.508: 43.27,46.7 43.27,48.07 40.64,50.7 R31.2 40.41,51.27 40.07,51.61 34.12,51.61 32.75,52.98 32.75,53.78 33.44,54.47 33.44,55.27 v33.53,55.37 | 43.27,46.7 43.27,39.15 T_AMP.V+ | v42.93,46.7 43.27,46.7
5VO
  Top 0.203: 38.58,48.07 37.59,49.06 63002.P$10 | R28.2 40.91,49.17 63002.P$1
  Top 0.508: C17.2 35.15,48.07 38.58,48.07 39.15,47.5 R28.2
AD0
  Top 0.254: 38.39,23.82 IMU.9 | 38.1,24.04 38.12,24.18 38.12,24.87 37.21,25.78 R30.2
  Top 0.305: 38.1,24.04 38.39,23.82 | R30.2 R29.1
GND  (via drill 0.4, 0.5, 0.61, 1.52, 3.17)
  Top 0.203: 63002.P$9 35.85,50.43 C16.1 35.85,50.42 39.12,50.42 38.86,50.68 38.86,51.82 37.46,53.22 LED5V.1 | 37.36,21.45 37.59,21.22 v37.59,20.07 37.59,18.28 37.6,18.27 | MAG.11 44.68,16.48 44.45,16.26 44.45,15.75 44.72,15.48 MAG.9 | C30.2 39.88,18.15 v39.88,14.99 | 20.07,16.07 20.05,15.36 v20.19,15.02
  Top 0.254: 42.65,22.24 42.53,22.15 | 37.89,23.02 IMU.11 | 11.32,39.1 10.69,39.73 R35.1 | 11.32,39.1 11.61,38.81 11.61,38.01 R33.1 | 11.32,39.1 12.75,40.53 15.61,40.53 16.29,39.84 16.52,39.84 16.98,39.38 PD_A_2.V- 17.09,38.93 17.09,39.38 18.12,40.41 20.64,40.41 21.09,40.87 PD_A_1.IN+ 21.21,40.98 22.01,40.98 PD_A_1.V- 22.01,41.1 22.01,41.33 23.15,42.47 24.18,42.47 26.12,44.41 26.92,44.41 PD.A | SAMD21J.P$7 17.55,27.27 17.55,28.64 19.84,30.92 C9.1 20.07,31.04 21.32,31.04 v21.35,31.1 | 41.33,7.95 41.9,7.95 PROGCONN.2 | 41.33,7.95 40.75,7.95 PROGCONN.3 | MAG.9 45.21,15.38 45.21,15.04 45.55,14.69 45.55,12.64 44.41,11.49 41.33,11.49 v41.25,11.46 41.33,11.38 41.33,7.95 | 20.07,16.07 SAMD21J.P$47 | v25.17,20.41 22.35,20.41 SAMD21J.P$54 | SAMD21J.P$22 11.27,22.92 6.69,22.92 v6.6,22.85 6.58,22.92 6.58,24.07 C6.2 | C14.2 48.18,16.52 49.33,16.52 v49.38,16.48 | C18.2 29.67,39.38 29.9,39.38 31.73,41.21 32.18,41.21 34.92,43.95 34.92,45.21 35.61,45.9 36.07,45.9 DEMUX.P$8 | 37.54,22.41 37.44,22.47 37.21,22.47 35.61,24.07 C25.2 | LTC3112.17 23.38,50.36 23.38,46.93 C20.2 | 13.32,2.97 12.18,2.97 C11.1 | 13.32,2.97 13.16,3.14 v13.21,3.05 | MRAM.P4 17.67,8.52 16.52,8.52 14.81,6.81 MRAM.P9 14.69,6.69 13.32,5.32 13.32,2.97
  Top 0.305: v3.98,48.85 11.64,49.14 R11.1 C26.2 | C19.2 18.2,50.11 v19.08,49.89 | R14.2 11.06,53.62 v9.79,53.84 | v9.52,45.35 13.1,45.33 R16.2 C27.2 R13.1 | C20.2 23.14,46.85 v24.6,46.85 | v26.6,46.35 27.18,45.77 PD.A | v37.33,46.61 37.38,46.15 DEMUX.P$8 | C16.1 34.47,51.22 v33.85,50.6 34.58,49.87 C17.1 | v29.85,54.85 29.64,54.85 LED3V6.1 | v36.1,55.35 37.18,55.35 LED5V.1 | v41.99,50.95 63002.P$3 63002.PAD 39.25,50.43 63002.P$9 | v52.6,49.35 52.41,49.54 63001.P$3 51.66,49.56 63001.PAD | v11.92,12.67 13.1,12.85 SAMD21J.P$33 | IMU.20 43.12,23.02 v43.35,22.79 42.61,22.3 42.62,22.3 42.53,22.15 | IMU.18 42.65,22.24 | R30.1 35.23,25.91 v34.1,25.04 34.76,24.13 C25.2 35.51,24.13 | 37.36,22.02 37.36,21.45 C24.2 37.54,22.41 37.89,23.02 | C30.2 37.6,18.16 v37.6,18.04 37.6,18.27 C5.2 | v45.85,50.6 47.17,50.6 C2.2 47.19,49.35 C1.2 47.48,49.04 63001.P$9 | LED3V3.1 46.36,54.35 v45.35,54.35 | LED-IR.1 44.31,32.83 v44.36,33.8
  Bottom 0.203: v37.59,20.07 37.6,20.05 | C4.2 28.96,20.8 28.96,20.57 29.21,20.32 | 29.21,20.32 29.21,19.3 27.18,19.3 26.16,20.32 26.16,20.83 25.49,21.49 | v39.88,14.99 41.25,13.62 v41.25,11.46 | v20.19,15.02 20.32,13.46 20.07,13.21 20.32,13.21 | 29.21,20.32 29.46,20.32 29.97,20.83 30.28,21.3 30.99,22.35
  Bottom 0.254: v25.17,20.41 25.49,21.49 25.9,21.89 C3.2 | 49.78,31.38 C13.1 49.78,31.38
  Bottom 0.305: C7.2 v11.92,12.67
  other vias: 2.54,53.98 53.98,53.98 53.98,2.54 2.54,2.54 4.89,13.76 4.89,16.3 4.89,11.22 2.54,40.64 2.54,38.1
  pour Bottom: -6.96,63.25 58.93,63.25 59.18,22.35 42.42,22.35 42.42,25.4 38.61,25.4 38.61,21.59 41.4,21.59 42.16,14.48 45.97,14.48 45.47,22.1 59.18,22.1 59.18,-2.92 -6.71,-2.92
N$1  (1 unrouted)
  Bottom 0.305: IR2.VDD 51.13,40.38 50.61,37.32 49.6,36.13 C13.2 48.43,33.19 PMOS.5 PMOS.6 PMOS.7 | PMOS.7 49.59,29.43 C12.2 50.89,29.23 IR1.VDD | PMOS.7 PMOS.8 47.47,27.89 R3.2
N$2
  Top 0.305: L1.2 54.44,50.04 63001.P$4
N$3
  Top 0.305: L1.1 53.59,47.36 51.91,49.04 63001.P$2
N$4
  Top 0.254: LTC3112.11 25.32,49.67 27.38,49.67 C21.1
N$5
  Top 0.203: LTC3112.14 25.71,51.2 C22.1
N$6  (via drill 0.5)
  Top 0.203: LTC3112.15 25.7,51.7 C23.2 v25.91,53.09
  Bottom 0.203: v25.91,53.09 C23.2
N$7
  Top 0.203: MAG.10 46.34,15.98 C14.1
N$8  (via drill 0.5)
  Top 0.203: SAMD21J.P$55 23.72,20.92 v24.13,21.08
  Bottom 0.203: v24.13,21.08 24.64,21.84 24.64,23.62 24.77,23.76 C3.1
N$9  (via drill 0.61)
  Top 0.508: v39.04,37.21 39.04,38.81 R24.1
  Bottom 0.508: 39.04,36.07 40.98,36.07 41.44,36.52 T_AMP.IN+ | 39.04,36.07 R20.2 | 39.04,36.07 v39.04,37.21
N$10  (via drill 0.61)
  Top 0.254: v34.92,36.87 33.67,35.61 R23.2
  Bottom 0.254: v34.92,36.87 34.92,38.93 37.33,41.33 38.81,41.33 39.73,40.41 R22.1 39.84,40.3 41.78,40.3 42.13,39.95 42.13,38.81 43.27,37.67 43.27,36.64 T_AMP.OUT
N$11
  Bottom 0.254: R22.2 38.01,40.3 38.01,38.7 R21.1 38.12,39.15 41.44,39.15 T_AMP.IN-
N$12
  Top 0.254: R32.1 16.41,36.75 16.52,36.64 18.47,36.64 1N4148.CATHODE 18.47,36.75 18.47,37.1 20.64,39.27 21.89,39.27 23.04,40.41 23.04,40.87 PD_A_1.OUT
N$13  (via drill 0.61)
  Top 0.254: v38.01,31.15 38.35,30.81 39.27,30.81 100T.P$1
  Bottom 0.254: v38.01,31.15 38.01,32.75 R19.2
N$14
  Top 0.254: 37.93,23.42 IMU.10
  Top 0.305: C25.1 37.93,23.42
N$15
  Top 0.254: R33.2 11.72,36.3 14.12,36.3 14.58,36.75 R32.2 14.69,36.87 15.61,37.78 17.44,37.78 17.89,38.24 17.89,38.81 PD_A_2.IN+
N$16  (via drill 0.51)
  Top 0.305: LED-IR.2 46.11,32.78 v45.62,36.83
  Bottom 0.305: v45.62,36.83 47.11,36.83 R38.1
N$17  (via drill 0.61)
  Top 0.254: 13.27,28.47 15.72,30.92 18.12,30.92 C9.2 | 13.27,28.47 12.64,27.84 12.64,26.47 12.86,26.24 16.75,26.24 17.09,26.58 17.09,27.15 SAMD21J.P$8 | v13.21,28.52 13.27,28.47
  Bottom 0.254: C10.2 9.32,34.24 9.32,32.41 9.55,32.18 L10.2 9.66,32.07 v13.21,28.52
N$19
  Top 0.254: R35.2 10.69,41.55 13.44,41.55 R34.1 13.55,41.55 14.46,42.47 16.41,42.47 17.44,41.44 17.89,41.44 PD_A_2.IN-
N$20
  Top 0.406: 0,57.15 57.1,57.1 57.15,0 0,0 0,57.15
N$21  (via drill 0.51)
  Top 0.305: v25.6,55.35 25.88,55.63 LED3V6.2
  Bottom 0.305: R39.1 25.6,45.27 25.6,46.85 26.85,48.1 26.85,54.1 v25.6,55.35
N$22  (via drill 0.61)
  Top 0.254: v42.01,52.87 39.27,55.61 LED5V.2
  Bottom 0.254: v42.01,52.87 40.64,52.87 R31.1
N$23  (via drill 0.51)
  Top 0.305: v49.6,54.1 49.57,54.13 LED3V3.2
  Bottom 0.305: R37.1 49.6,50.75 v49.6,54.1
N$36
  Top 0.254: MAG.8 44.76,14.92 44.76,13.55 C15.1
N$40
  Top 0.254: LTC3112.12 25.32,50.24 25.32,50.7 LTC3112.13 25.44,50.7 26.92,50.7 27.38,51.16 C22.2 27.49,51.27 30.12,51.27 30.47,51.61 L4.1
N$45
  Top 0.305: L3.2 43.75,50.1 41.6,50.1 41.27,50.43 63002.P$2
N$46
  Top 0.305: L3.1 44.23,52.5 63002.P$4
N$53
  Top 0.254: LTC3112.10 25.32,49.1 25.32,48.76 LTC3112.9 25.44,48.76 26.58,48.76 27.38,47.95 C21.2 27.49,47.95 29.55,47.95 30.47,48.87 L4.2
N$54  (via drill 0.61)
  Top 0.254: 17.95,52.01 17.21,52.76 R10.1 17.09,52.87 16.87,52.87 15.15,54.59 14.92,54.59 R15.2 | 17.95,52.01 18.24,51.73 21.32,51.73 LTC3112.2 | 17.95,52.01 v18.45,52.58
  Bottom 0.254: 17.78,52.41 17.78,54.47 17.67,54.59 C28.2 | 17.78,52.41 R9.2 | v18.45,52.58 17.78,52.41
N$69
  Top 0.203: LTC3112.3 17.63,51.2 17.02,51.82 14.59,51.82 R12.2
  Top 0.254: R11.2 8.64,50.93 11.15,50.93 C26.1 11.27,51.04 11.38,51.16 13.89,51.16 R12.2
N$70
  Top 0.254: R15.1 16.75,54.59 19.15,54.59 C29.1
N$71  (via drill 0.61)
  Top 0.254: 21.32,53.21 21.32,54.24 20.98,54.59 C29.2 | 21.32,53.21 21.32,52.3 LTC3112.1 | 21.32,53.21 v20.87,53.21
  Bottom 0.254: v20.87,53.21 19.49,54.59 C28.1
N$999
  Top 0.254: R14.1 12.86,52.87 15.26,52.87 R10.2
PA12  (via drill 0.61)
  Top 0.254: v26.49,28.08 21.89,26.81 14.46,19.38 11.38,19.38 SAMD21J.P$29
  Bottom 0.254: v26.49,28.08 27.27,26.81 28.98,25.09 33.1,25.09 34.7,26.7 42.47,26.7 43.5,27.72 43.5,31.15 42.7,31.95 42.01,31.95 PMOS.4
PA20[2]  (via drill 0.61, 1.52)
  Top 0.254: v17.09,17.55 SAMD21J.P$41
  Bottom 0.254: v17.09,17.55 4.18,30.47 2.69,30.47 v2.6,30.54
PA21[3]  (via drill 0.5, 1.52)
  Top 0.203: v2.56,33.04 8.42,27.18 v10.92,27.18 | v18.29,20.83 17.02,19.56 v16.51,19.56 | v18.29,17.53 17.59,16.83 SAMD21J.P$42
  Bottom 0.203: v10.92,27.18 17.27,20.83 v18.29,20.83 | v16.51,19.56 v18.29,17.53
PA22  (via drill 0.61, 1.52)
  Top 0.254: v21.02,9.38 18.12,13.55 18.12,16.07 SAMD21J.P$43
  Bottom 0.254: 27.84,7.95 27.84,9.55 v27.94,9.66 27.72,9.21 24.41,9.21 23.72,9.89 v21.02,9.38
PA23  (via drill 0.5, 1.52)
  Top 0.203: v19.05,13.97 18.59,14.43 SAMD21J.P$44
  Bottom 0.203: v32.73,9.66 31.49,9.66 29.97,11.18 24.13,11.18 23.37,10.41 23.34,10.41 23.24,10.32 19.97,10.32 19.56,9.91 18.54,10.92 18.54,13.46 v19.05,13.97
PA24  (via drill 0.5, 1.52)
  Top 0.203: v23.37,15.75 21.84,15.75 20.57,14.22 19.81,14.22 19.05,15.24 19.05,16.13 SAMD21J.P$45
  Top 0.254: 19.04,16.07 SAMD21J.P$45
  Bottom 0.203: 25.44,14.92 24.19,14.92 v23.37,15.75
  Bottom 0.254: 25.44,14.92 27.61,12.75 v27.69,12.7
PA25  (via drill 0.61, 1.52)
  Top 0.254: v23.38,16.98 23.27,17.35 19.84,17.35 19.61,16.87 19.61,16.18 SAMD21J.P$46
  Bottom 0.254: v23.38,16.98 28.41,16.98 32.64,12.75 v32.73,12.7
PA30  (via drill 0.61)
  Top 0.254: v25.58,26.66 21.67,25.9 21.44,25.67 21.44,22.24 21.78,21.89 22.24,21.89 SAMD21J.P$57 | v27.95,20.3 28.64,20.3 36.98,11.95 36.98,6.24 37.67,5.55 41.21,5.55 41.9,4.86 41.9,4.06 PROGCONN.9
  Bottom 0.254: v25.58,26.66 26.92,24.3 26.92,21.32 v27.95,20.3
PA31
  Top 0.254: SAMD21J.P$58 22.35,22.47 29.55,22.47 37.44,14.58 37.44,6.46 37.9,6.01 42.01,6.01 43.16,4.86 43.16,4.06 PROGCONN.10
PB00  (via drill 1.52)
  Top 0.254: 14.35,38.93 16.07,38.93 PD_A_2.OUT | 14.35,38.93 13.55,39.73 R34.2 | 31.84,33.78 31.84,35.5 R23.1 31.84,35.61 31.38,36.07 31.38,39.27 C18.1 | 31.84,33.78 31.84,25.44 31.5,25.09 29.9,25.09 28.75,23.95 22.35,23.95 SAMD21J.P$61 | 31.84,33.78 28.98,33.78 27.49,32.3 26.7,32.3 v26.67,32.26 26.58,32.3 14.01,32.3 10.69,35.61 10.69,36.75 10.92,36.98 12.29,36.98 14.24,38.93 14.35,38.93
PB01  (via drill 1.52)
  Top 0.203: SAMD21J.P$62 27.98,24.42 v30.23,26.67
PB02  (via drill 1.52)
  Top 0.254: SAMD21J.P$63 22.35,24.98 25.67,24.98 30.12,29.44 v30.23,29.46
PB03  (via drill 0.5, 1.52)
  Top 0.203: SAMD21J.P$64 24.15,25.42 v24.38,25.65
  Bottom 0.203: v24.38,25.65 24.38,27.18 26.92,29.72 27.69,29.72 v30.23,32.26
PB06  (via drill 0.5)
  Top 0.203: R13.2 19.56,47.38 19.56,48.51 20.24,49.2 LTC3112.7 | C27.1 16.65,47.13 v15.75,46.23 | v16.51,29.97 16.59,29.89 SAMD21J.P$9
  Top 0.254: C27.1 17.09,47.16 19.72,47.16 R13.2
  Bottom 0.203: v15.75,46.23 15.75,45.97 12.95,43.18 12.95,34.04 16.51,30.48 v16.51,29.97
PB16  (via drill 0.61, 1.52)
  Top 0.254: v20.02,8.37 16.07,13.59 16.07,16.07 SAMD21J.P$39
  Bottom 0.254: v32.94,4.99 32.87,4.98 30.47,4.98 30.47,5.44 29.21,6.69 23.72,6.69 v20.02,8.37
PB17  (via drill 0.5, 1.52)
  Top 0.203: v22.86,2.79 22.35,3.3 17.02,3.3 15.75,4.57 v15.75,4.83 | v17.02,13.97 16.59,14.39 SAMD21J.P$40
  Bottom 0.203: 26.47,5.09 24.17,2.79 v22.86,2.79 | v15.75,4.83 17.02,6.1 v17.02,13.97
  Bottom 0.254: 26.47,5.09 27.84,5.09 v27.9,5.18
PD-IN
  Top 0.254: DEMUX.P$9 30.58,45.9 30.12,45.9 28.64,44.41 28.64,42.7 27.61,41.67 24.87,41.67 23.72,40.53 23.72,40.18 22.81,39.27 22.58,39.27 21.67,38.35 21.21,38.35 PD_A_1.IN- 21.32,38.24 21.32,36.64 1N4148.ANODE
PD-OUT  (via drill 0.61, 1.52)
  Top 0.254: DEMUX.P$10 30.7,45.33 31.27,45.33 31.5,45.55 31.5,46.24 31.27,46.47 30.01,46.47 28.18,44.64 28.18,43.84 27.04,42.7 PD.C 27.04,42.58 v25.55,42.58
  Bottom 0.254: v25.55,42.58 26.12,42.01 26.12,40.18 v26.16,40.13
RESETN
  Top 0.254: SAMD21J.P$52 22.35,19.38 28.87,19.38 36.52,11.72 36.52,5.66 38.12,4.06 PROGCONN.6
RUN  (via drill 0.61)
  Top 0.203: LTC3112.6 19.97,49.69 18.29,48.01 14.73,48.01 14.22,47.5 R16.1
  Top 0.254: v12.18,32.87 12.18,20.64 11.95,20.41 11.38,20.41 SAMD21J.P$27 | v11.82,46.5 13.32,46.24 14.12,47.04 R16.1
  Bottom 0.254: v12.18,32.87 12.18,45.33 v11.82,46.5
S1
  Top 0.254: SAMD21J.P$50 22.35,18.47 24.75,18.47 31.15,12.06 31.15,8.41 33.1,6.46 34.24,6.46 37.44,3.26 37.44,2.58 37.67,2.35 43.73,2.35 50.13,8.75 50.13,23.95 46.93,27.15 46.93,38.58 43.61,41.9 36.3,41.9 DEMUX.P$2
SCK  (via drill 0.61)
  Top 0.254: R8.1 9.66,7.26 11.72,7.26 MRAM.P6 11.84,7.38 v12.98,8.52 | v15.61,17.44 15.61,16.18 SAMD21J.P$38
  Bottom 0.254: v15.61,17.44 15.61,11.15 v12.98,8.52
SCL  (via drill 0.5, 0.61, 1.52)
  Top 0.203: IMU.23 v44.79,24.21
  Top 0.254: 10.46,20.98 4.64,20.98 4.29,21.32 R17.1 4.64,20.87 2.81,19.04 v2.72,19.01 | 10.46,20.98 11.27,20.98 SAMD21J.P$26 | v41.44,17.09 42.58,17.09 MAG.1 | 10.46,20.98 10.46,17.67 10.69,17.44 12.48,17.44 14.11,18.81 v19.61,18.81
  Bottom 0.203: v44.79,24.21 45.36,23.63 46.72,23.63
  Bottom 0.254: 41.44,18.35 v41.44,17.09 | 41.44,18.35 46.72,23.63 46.93,23.84 51.04,23.84 51.27,24.07 53.41,27.71 | v19.61,18.81 40.87,18.81 41.33,18.35 41.44,18.35
  Bottom 0.305: IR2.SCL 53.41,27.71 IR1.SCL
SDA  (via drill 0.5, 0.61, 1.52)
  Top 0.203: IMU.24 42.56,25.15 45.21,25.15 45.97,24.38 v45.97,21.59 | SAMD21J.P$25 11.18,21.59 5.82,21.59 R18.1
  Top 0.254: R18.1 4.18,23.15 4.18,24.87 3.26,25.78 v3.19,25.87 4.29,24.87 9.21,24.87 v10.12,25.78 | v42.36,18.01 42.81,17.55 43.16,17.55 MAG.16
  Top 0.305: IR1.SDA 54.37,36.99 IR2.SDA
  Bottom 0.203: v45.97,21.59 48.05,19.51 49.57,19.51
  Bottom 0.254: IR1.SDA 54.36,25.67 54.36,24.3 49.57,19.51 48.07,18.01 v42.36,18.01 42.36,16.75 41.78,16.18 38.35,16.18 36.64,17.89 19.27,17.89 11.38,25.78 v10.12,25.78
SETC
  Top 0.254: MAG.12 45.21,17.09 45.44,17.09 45.9,17.55 46.81,17.55 47.16,17.21 47.16,14.01 46.7,13.55 C15.2
SI  (via drill 0.5)
  Top 0.203: 10.41,8.64 10.16,8.64 9.14,9.65 v9.14,10.92 | v14.79,13.99 15.15,14.35 SAMD21J.P$37
  Top 0.254: MRAM.P5 11.72,8.64 10.41,8.64 10.24,8.64 9.66,9.21 R7.1
  Bottom 0.203: v9.14,10.92 9.91,9.65 13.46,9.65 14.73,11.43 v14.79,13.99
SO  (via drill 0.61)
  Top 0.203: SAMD21J.P$35 14.09,17.4 13.97,17.53 14.73,18.29 18.8,18.29 19.05,18.03 20.83,18.03 21.23,18.44
  Top 0.254: v28.87,41.44 30.01,42.58 30.58,42.58 DEMUX.P$14 | v20.18,20.87 20.18,19.49 21.23,18.44 21.78,17.89 22.24,17.89 SAMD21J.P$49 22.47,17.89 23.72,17.89 24.3,17.32 24.3,15.04 22.7,13.44 22.7,7.72 22.01,7.04 22.01,6.46 R4.1 21.89,6.35 21.67,6.12 17.78,6.12 MRAM.P2
  Bottom 0.254: v28.87,41.44 28.87,37.21 20.18,28.52 v20.18,20.87
TEMP-IN
  Top 0.254: DEMUX.P$7 36.18,45.21 35.61,45.21 35.38,44.98 35.38,40.64 37.1,38.93 R24.2 37.21,38.81 37.21,35.95 39.27,33.9 39.27,32.87 100T.P$3
TEMP-OUT
  Top 0.254: DEMUX.P$5 36.3,43.84 39.27,43.84 39.84,43.27 40.64,43.27 41.44,44.07 41.44,44.76 TEMP.3
VIN  (via drill 0.5, 0.51, 2.54)
  Top 0.203: v39.37,53.34 40.39,53.34 40.89,52.83 40.89,51.94 63002.P$5 | C16.2 36.59,52.92 63002.P$6 63002.P$7 63002.P$8
  Top 0.254: LTC3112.5 21.44,50.24 LTC3112.4 21.32,50.7 16.18,50.7 16.07,50.81 C19.1 15.95,50.81 15.15,50.81 14.58,50.24 11.95,50.24 11.84,50.13 7.95,50.13 6.81,51.27 6.81,53.44 v7.32,53.72 | 25.07,54.1 25.07,52.3 LTC3112.16 | C16.2 35.04,52.98 34.35,52.98 34.01,53.33 v33.85,53.35
  Top 0.305: 63001.P$5 51.1,51.11 51.1,52.1 48.85,52.1 48.35,51.6 | 48.35,51.6 63001.P$6 63001.P$7 63001.P$8 | 48.35,51.6 47.97,51.6 C2.1 46.72,52.85 v46.1,52.85
  Top 0.406: v33.85,53.35 33.6,53.6 29.35,53.6 28.85,54.1 25.07,54.1 v24.1,54.1 | v12.85,55.6 12.1,54.85 8.04,54.9 7.04,54.16 7.57,53.91 v7.32,53.72
  Bottom 0.203: 42.35,53.85 39.37,53.59 v39.37,53.34
  Bottom 0.406: v46.1,52.85 43.35,52.85 42.35,53.85 39.1,53.85 38.6,53.35 v33.85,53.35 | v24.1,54.1 22.35,55.85 15.1,55.85 14.85,55.6 v12.85,55.6
~1OE  (via drill 0.5)
  Top 0.203: 35.84,34.58 35.84,34.31 35.05,33.53 34.8,33.53 v34.04,32.77 | v33.27,27.69 33.27,22.35 v32.51,21.59 | v30.23,20.07 30.48,20.07 v33.78,16.76 | v30.23,16.51 29.97,16.51 27.58,18.9 22.37,18.9 SAMD21J.P$51
  Top 0.254: DEMUX.P$1 36.3,41.33 38.01,39.61 38.01,35.84 40.41,33.44 40.41,32.07 40.18,31.84 38.58,31.84 35.84,34.58 35.84,38.12 35.27,38.7 R1.1
  Bottom 0.203: v34.04,32.77 34.04,28.45 v33.27,27.69 | v32.51,21.59 31.75,21.59 v30.23,20.07 | v33.78,16.76 30.48,16.76 v30.23,16.51
~2OE  (via drill 0.61)
  Top 0.254: v21.09,19.95 22.24,19.95 SAMD21J.P$53 | v31.84,42.13 31.73,42.01 30.7,42.01 DEMUX.P$15
  Bottom 0.254: v21.09,19.95 21.09,27.65 28.21,30.94 28.75,34.47 31.38,37.1 R2.1 31.5,37.21 31.84,37.55 v31.84,42.13
~CS
  Top 0.203: 14.07,13.49 14.04,14.34 14.22,14.48 14.59,15.1 SAMD21J.P$36
  Top 0.254: R25.1 21.89,4.75 17.78,4.75 MRAM.P1 17.67,4.86 16.98,5.55 16.98,7.72 17.21,7.95 18.24,7.95 18.58,8.29 18.58,8.98 14.07,13.49 | 14.58,15.81 SAMD21J.P$36
~HOLD
  Top 0.254: MRAM.P7 11.72,6.01 10.24,6.01 9.66,5.44 R6.1
~WP
  Top 0.254: MRAM.P3 17.78,7.38 20.87,7.38 21.67,8.18 R5.1

### Text on the board
tPlace: GND | Brown Space Engineering / EquiSat Processor Test Board V2 / September 2016 / Ryan Izant
bPlace: Brown Space Engineering / EquiSat Processor Test Board V2 / September 2016 / Ryan Izant
Reference: 3V3 | GND | 5V | GND | VIN | 3V6 | GND | GND | 3V3 | PA21[3] | PB03 | PB00 | PA20[2] | PB02 | SDA | PB01 | SCL | PA24 | PA25 | PA22 | PA23 | GND | PB16 | GND | PB17